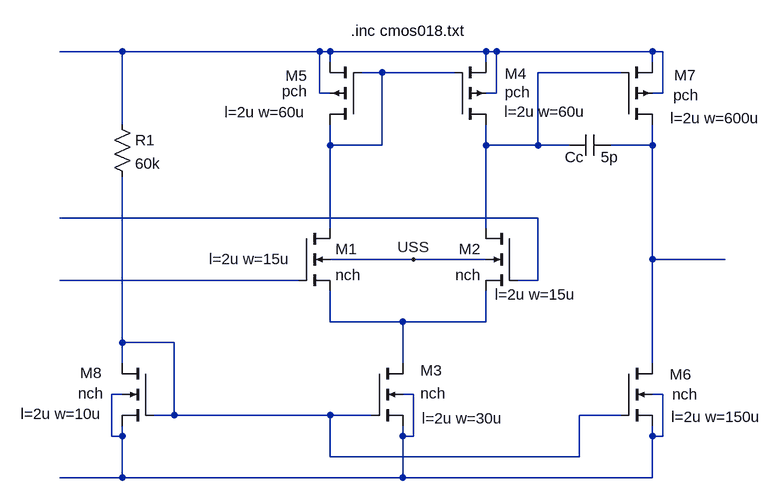
[diagram p0: schematic test.asc]
test.asc, the LTspice schematic file:
Version 4
SHEET 1 1112 680
WIRE -224 -96 -320 -96
WIRE 80 -96 -224 -96
WIRE 96 -96 80 -96
WIRE 336 -96 96 -96
WIRE 352 -96 336 -96
WIRE 592 -96 352 -96
WIRE 608 -96 592 -96
WIRE 96 -80 96 -96
WIRE 336 -80 336 -96
WIRE 592 -80 592 -96
WIRE 176 -64 144 -64
WIRE 288 -64 176 -64
WIRE 544 -64 416 -64
WIRE 80 -32 80 -96
WIRE 96 -32 80 -32
WIRE 352 -32 352 -96
WIRE 352 -32 336 -32
WIRE 608 -32 608 -96
WIRE 608 -32 592 -32
WIRE -224 16 -224 -96
WIRE 96 48 96 16
WIRE 176 48 176 -64
WIRE 176 48 96 48
WIRE 336 48 336 16
WIRE 416 48 416 -64
WIRE 416 48 336 48
WIRE 464 48 416 48
WIRE 592 48 592 16
WIRE 592 48 528 48
WIRE 416 160 -320 160
WIRE 96 176 96 48
WIRE 336 176 336 48
WIRE 224 224 96 224
WIRE 336 224 224 224
WIRE 592 224 592 48
WIRE 704 224 592 224
WIRE 48 256 -320 256
WIRE 416 256 416 160
WIRE 416 256 384 256
WIRE 96 320 96 272
WIRE 208 320 96 320
WIRE 336 320 336 272
WIRE 336 320 208 320
WIRE -224 352 -224 96
WIRE -144 352 -224 352
WIRE -224 384 -224 352
WIRE 208 384 208 320
WIRE 592 384 592 224
WIRE -224 432 -240 432
WIRE 224 432 208 432
WIRE 608 432 592 432
WIRE -144 464 -144 352
WIRE -144 464 -176 464
WIRE 96 464 -144 464
WIRE 160 464 96 464
WIRE 544 464 480 464
WIRE -240 496 -240 432
WIRE -224 496 -224 480
WIRE -224 496 -240 496
WIRE 208 496 208 480
WIRE 224 496 224 432
WIRE 224 496 208 496
WIRE 592 496 592 480
WIRE 608 496 608 432
WIRE 608 496 592 496
WIRE 96 528 96 464
WIRE 480 528 480 464
WIRE 480 528 96 528
WIRE -224 560 -224 496
WIRE -224 560 -320 560
WIRE 208 560 208 496
WIRE 208 560 -224 560
WIRE 592 560 592 496
WIRE 592 560 208 560
FLAG 224 224 USS
DATAFLAG -128 -96 ""
SYMBOL nmos4 48 176 R0
WINDOW 123 -138 47 Left 2
SYMATTR Value2 l=2u w=15u
SYMATTR InstName M1
SYMATTR Value nch
SYMBOL nmos4 384 176 M0
WINDOW 123 -91 102 Left 2
SYMATTR Value2 l=2u w=15u
SYMATTR InstName M2
SYMATTR Value nch
SYMBOL nmos4 160 384 R0
WINDOW 123 77 85 Left 2
WINDOW 0 75 11 Left 2
WINDOW 3 75 46 Left 2
SYMATTR Value2 l=2u w=30u
SYMATTR InstName M3
SYMATTR Value nch
SYMBOL pmos4 288 16 M180
WINDOW 123 76 20 Left 2
WINDOW 0 77 78 Left 2
WINDOW 3 77 50 Left 2
SYMATTR Value2 l=2u w=60u
SYMATTR InstName M4
SYMATTR Value pch
SYMBOL pmos4 144 16 R180
WINDOW 123 85 19 Left 2
WINDOW 0 83 75 Left 2
WINDOW 3 83 51 Left 2
SYMATTR Value2 l=2u w=60u
SYMATTR InstName M5
SYMATTR Value pch
SYMBOL nmos4 544 384 R0
WINDOW 123 77 82 Left 2
WINDOW 0 75 17 Left 2
WINDOW 3 79 48 Left 2
SYMATTR Value2 l=2u w=150u
SYMATTR InstName M6
SYMATTR Value nch
SYMBOL pmos4 544 16 M180
WINDOW 123 76 10 Left 2
WINDOW 0 82 76 Left 2
WINDOW 3 80 45 Left 2
SYMATTR Value2 l=2u w=600u
SYMATTR InstName M7
SYMATTR Value pch
SYMBOL nmos4 -176 384 M0
WINDOW 123 79 78 Left 2
WINDOW 0 79 15 Left 2
WINDOW 3 77 46 Left 2
SYMATTR Value2 l=2u w=10u
SYMATTR InstName M8
SYMATTR Value nch
SYMBOL res -240 0 R0
SYMATTR InstName R1
SYMATTR Value 60k
SYMBOL cap 528 32 R90
WINDOW 0 50 56 VBottom 2
WINDOW 3 19 2 VTop 2
SYMATTR InstName Cc
SYMATTR Value 5p
TEXT 128 -128 Left 2 !.inc cmos018.txt

The netlist it stands for:
* test.asc
M1 N002 N006 N007 USS nch l=2u w=15u
M2 N003 N005 N007 USS nch l=2u w=15u
M3 N007 N008 N009 N009 nch l=2u w=30u
M4 N003 N002 N001 N001 pch l=2u w=60u
M5 N002 N002 N001 N001 pch l=2u w=60u
M6 N004 N008 N009 N009 nch l=2u w=150u
M7 N004 N003 N001 N001 pch l=2u w=600u
M8 N008 N008 N009 N009 nch l=2u w=10u
R1 N001 N008 60k
Cc N004 N003 5p
.model NMOS NMOS
.model PMOS PMOS
.lib standard.mos
.inc cmos018.txt
.backanno
.end